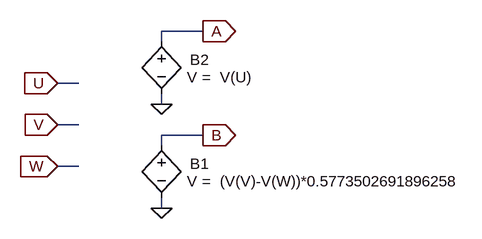
[diagram p0: schematic clarke.asc]
clarke.asc, the LTspice schematic file:
Version 4
SHEET 1 880 680
WIRE 240 0 176 0
WIRE 176 16 176 0
WIRE 48 80 16 80
WIRE 176 112 176 96
WIRE 48 144 16 144
WIRE 240 160 176 160
WIRE 176 176 176 160
WIRE 48 208 16 208
WIRE 176 272 176 256
FLAG 16 80 U
IOPIN 16 80 In
FLAG 16 144 V
IOPIN 16 144 In
FLAG 176 272 0
FLAG 240 160 B
IOPIN 240 160 Out
FLAG 16 208 W
IOPIN 16 208 In
FLAG 176 112 0
FLAG 240 0 A
IOPIN 240 0 Out
SYMBOL bv 176 160 R0
WINDOW 0 44 44 Left 0
WINDOW 3 39 71 Left 0
SYMATTR InstName B1
SYMATTR Value V =  (V(V)-V(W))*0.5773502691896258
SYMBOL bv 176 0 R0
WINDOW 0 44 44 Left 0
WINDOW 3 39 71 Left 0
SYMATTR InstName B2
SYMATTR Value V =  V(U)

The netlist it stands for:
* clarke.asc
B1 B 0 V =  (V(V)-V(W))*0.5773502691896258
B2 A 0 V =  V(U)
.backanno
.end